# EAGLE schematic Wall-Switcher (EAGLE 8.3.2)
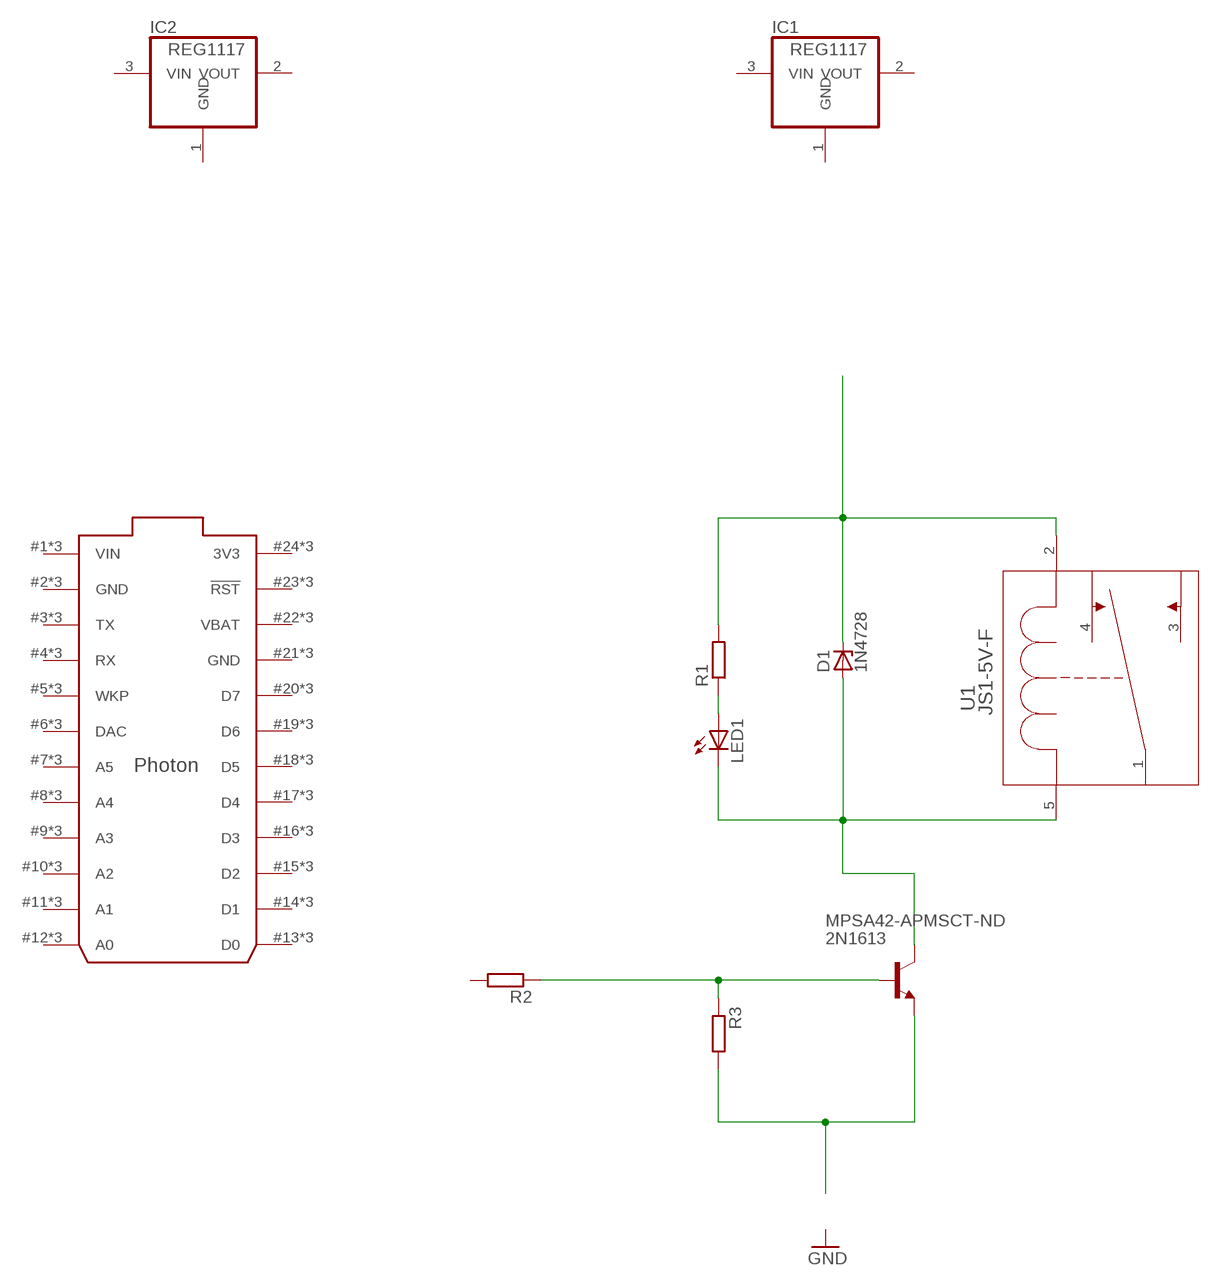
[diagram p0: schematic, sheet 1]

## Parts
D1  1N4728  [DO41Z10]
IC1  REG1117  [SOT223]
IC2  REG1117  [SOT223]
LED1  LED5MM  [LED5MM]
MPSA42-APMSCT-ND  2N1613  [TO5]
R1  R0204/7  [0204/7]
R2  R0204/7  [0204/7]
R3  R0204/7  [0204/7]
U1  JS1-5V-F  [RELAY_JS_1C]
U$1  PHOTON_WITH_STACKABLE_HEADERS  [PHOTON_STACKABLE]

## Nets
N$1: D1.A LED1.K(C) MPSA42-APMSCT-ND.3(C) U1.5
N$2: LED1.A R1.1
N$3: D1.C R1.2 U1.2
N$5: MPSA42-APMSCT-ND.2(B) R2.1 R3.1
N$6: MPSA42-APMSCT-ND.1(E) R3.2
Unconnected: IC1.2(VOUT) IC1.3(VIN) IC2.2(VOUT) IC2.3(VIN) R2.2 U1.1 U1.3 U1.4 U$1.3(TX) U$1.4(RX) U$1.5(WKP) U$1.6(DAC) U$1.7(A5) U$1.8(A4) U$1.9(A3) U$1.10(A2) U$1.11(A1) U$1.12(A0) U$1.13(D0) U$1.14(D1) U$1.15(D2) U$1.16(D3) U$1.17(D4) U$1.18(D5) U$1.19(D6) U$1.20(D7) U$1.23(!RST) U$1.#3(TX) U$1.#4(RX) U$1.#5(WKP) U$1.#6(DAC) U$1.#7(A5) U$1.#8(A4) U$1.#9(A3) U$1.#10(A2) U$1.#11(A1) U$1.#12(A0) U$1.#13(D0) U$1.#14(D1) U$1.#15(D2) U$1.#16(D3) U$1.#17(D4) U$1.#18(D5) U$1.#19(D6) U$1.#20(D7) U$1.#23(!RST) U$1.@3(TX) U$1.@4(RX) U$1.@5(WKP) U$1.@6(DAC) U$1.@7(A5) U$1.@8(A4) U$1.@9(A3) U$1.@10(A2) U$1.@11(A1) U$1.@12(A0) U$1.@13(D0) U$1.@14(D1) U$1.@15(D2) U$1.@16(D3) U$1.@17(D4) U$1.@18(D5) U$1.@19(D6) U$1.@20(D7) U$1.@23(!RST)

## Power pins joined to a net without a drawn wire
3V3: U$1.24(3V3) U$1.#24(3V3) U$1.@24(3V3)
GND: IC1.1(GND) IC2.1(GND) U$1.2(GND) U$1.21(GND) U$1.#2(GND) U$1.#21(GND) U$1.@2(GND) U$1.@21(GND)
VBAT: U$1.22(VBAT) U$1.#22(VBAT) U$1.@22(VBAT)
VIN: U$1.1(VIN) U$1.#1(VIN) U$1.@1(VIN)

## Library data of the parts
D1 = diode:1N4728: Z DIODE 3.3 V, 1W, 5 percent
IC1 IC2 = burr-brown:REG1117: 800mA and 1A Low Dropout (LDO) Positive Regulator 1.8V, 2.5V, 2.85V, 3.3V, 5V, and Adj; MPN: REG1117; OC_FARNELL: 1097566; OC_NEWARK: 14P6981
LED1 = led:LED: LED OSRAM: - CHIPLED LG R971, LG N971, LY N971, LG Q971, LY Q971, LO R971, LY R971 LH N974, LH R974 LS Q976, LO Q976, LY Q976 LO Q996 - Hyper CHIPLED LW Q18S LB Q993, LB Q99A, LB R99A - SideLED LS A670, LO A670, LY A670, LG A670, LP A670 LB A673, LV A673, LT A673, LW A673 LH A674 LY A675 LS A676, LA A676, LO A676, LY A676, LW A676 LS A679, LY A679, LG A679 - Hyper Micro SIDELED® LS Y876, LA Y876, LO Y876, LY Y876 LT Y87S - SmartLED LW L88C, LW L88S LB L89C, LB L89S, LG L890 LS L89K, LO L89K, LY L89K LS L896, LA L896, LO L896, LY L896 - TOPLED LS T670, LO T670, LY T670, LG T670, LP T670 LSG T670, LSP T670, LSY T670, LOP T670, LYG T670 LG T671, LOG T671, LSG T671 LB T673, LV T673, LT T673, LW T673 LH T674 LS T676, LA T676, LO T676, LY T676, LB T676, LH T676, LSB T676, LW T676 LB T67C, LV T67C, LT T67C, LS T67K, LO T67K, LY T67K, LW E67C LS E67B, LA E67B, LO E67B, LY E67B, LB E67C, LV E67C, LT E67C LW T67C LS T679, LY T679, LG T679 LS T770, LO T770, LY T770, LG T770, LP T770 LB T773, LV T773, LT T773, LW T773 LH T774 LS E675, LA E675, LY E675, LS T675 LS T776, LA T776, LO T776, LY T776, LB T776 LHGB T686 LT T68C, LB T68C - Hyper Mini TOPLED® LB M676 - Mini TOPLED Santana® LG M470 LS M47K, LO M47K, LY M47K Source: http://www.osram.convergy.de LUXEON: - LUMILED® LXK2-PW12-R00, LXK2-PW12-S00, LXK2-PW14-U00, LXK2-PW14-V00 LXK2-PM12-R00, LXK2-PM12-S00, LXK2-PM14-U00 LXK2-PE12-Q00, LXK2-PE12-R00, LXK2-PE12-S00, LXK2-PE14-T00, LXK2-PE14-U00 LXK2-PB12-K00, LXK2-PB12-L00, LXK2-PB12-M00, LXK2-PB14-N00, LXK2-PB14-P00, LXK2-PB14-Q00 LXK2-PR12-L00, LXK2-PR12-M00, LXK2-PR14-Q00, LXK2-PR14-R00 LXK2-PD12-Q00, LXK2-PD12-R00, LXK2-PD12-S00 LXK2-PH12-R00, LXK2-PH12-S00 LXK2-PL12-P00, LXK2-PL12-Q00, LXK2-PL12-R00 Source: www.luxeon.com KINGBRIGHT: KA-3528ASYC Source: www.kingbright.com
MPSA42-APMSCT-ND = transistor:2N1613: NPN TRANSISTOR
R1-R3 = eagle-ltspice:R: RESISTOR, European symbol; SPICEMODEL: NONE; SPICEPREFIX: R
U1 = Photon-Power-Relay:JS1-5V-F; MANUFACTURER_PART_NUMBER: JS15VF; VENDOR: Panasonic
U$1 = Spark:PHOTON